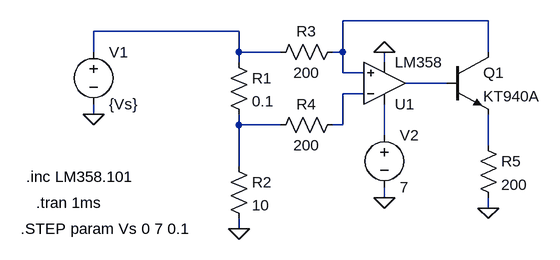
[diagram p0: schematic current-sensing-common-mode.asc]
current-sensing-common-mode.asc, the LTspice schematic file:
Version 4
SHEET 1 880 680
WIRE 496 32 272 32
WIRE 112 48 -112 48
WIRE -112 80 -112 48
WIRE 112 80 112 48
WIRE 176 80 112 80
WIRE 272 80 272 32
WIRE 272 80 256 80
WIRE 496 80 496 32
WIRE 112 96 112 80
WIRE 336 96 336 80
WIRE 272 112 272 80
WIRE 304 112 272 112
WIRE 432 128 368 128
WIRE 304 144 272 144
WIRE -112 176 -112 160
WIRE 112 192 112 176
WIRE 176 192 112 192
WIRE 272 192 272 144
WIRE 272 192 256 192
WIRE 336 208 336 160
WIRE 496 224 496 176
WIRE 112 256 112 192
WIRE 336 304 336 288
WIRE 496 320 496 304
WIRE 112 352 112 336
FLAG -112 176 0
FLAG 112 352 0
FLAG 336 304 0
FLAG 336 80 0
FLAG 496 320 0
SYMBOL Opamps\\opamp2 336 192 M180
SYMATTR InstName U1
SYMATTR Value LM358
SYMBOL voltage -112 64 R0
WINDOW 123 0 0 Left 2
WINDOW 39 0 0 Left 2
SYMATTR InstName V1
SYMATTR Value {Vs}
SYMBOL res 96 80 R0
SYMATTR InstName R1
SYMATTR Value 0.1
SYMBOL res 96 240 R0
SYMATTR InstName R2
SYMATTR Value 10
SYMBOL voltage 336 192 R0
WINDOW 123 0 0 Left 2
WINDOW 39 0 0 Left 2
SYMATTR InstName V2
SYMATTR Value 7
SYMBOL res 160 96 R270
WINDOW 0 32 56 VTop 2
WINDOW 3 0 56 VBottom 2
SYMATTR InstName R3
SYMATTR Value 200
SYMBOL res 160 208 R270
WINDOW 0 32 56 VTop 2
WINDOW 3 0 56 VBottom 2
SYMATTR InstName R4
SYMATTR Value 200
SYMBOL npn 432 80 R0
SYMATTR InstName Q1
SYMATTR Value KT940A
SYMBOL res 480 208 R0
SYMATTR InstName R5
SYMATTR Value 200
TEXT -216 272 Left 2 !.inc LM358.101
TEXT -200 312 Left 2 !.tran 1ms
TEXT -224 352 Left 2 !.STEP param Vs 0 7 0.1

The netlist it stands for:
* current-sensing-common-mode.asc
XU1 N001 N004 N006 0 N003 LM358  ; pins In+ In- V+ V- OUT
V1 N002 0 {Vs}
R1 N002 N005 0.1
R2 N005 0 10
V2 N006 0 7
R3 N002 N001 200
R4 N005 N004 200
Q1 N001 N003 N007 0 KT940A
R5 N007 0 200
.model NPN NPN
.model PNP PNP
.lib standard.bjt
.inc LM358.101
.tran 1ms
.STEP param Vs 0 7 0.1
.backanno
.end